# Altium project Lpad_28027_connect_Project _v1.1.PrjPcb
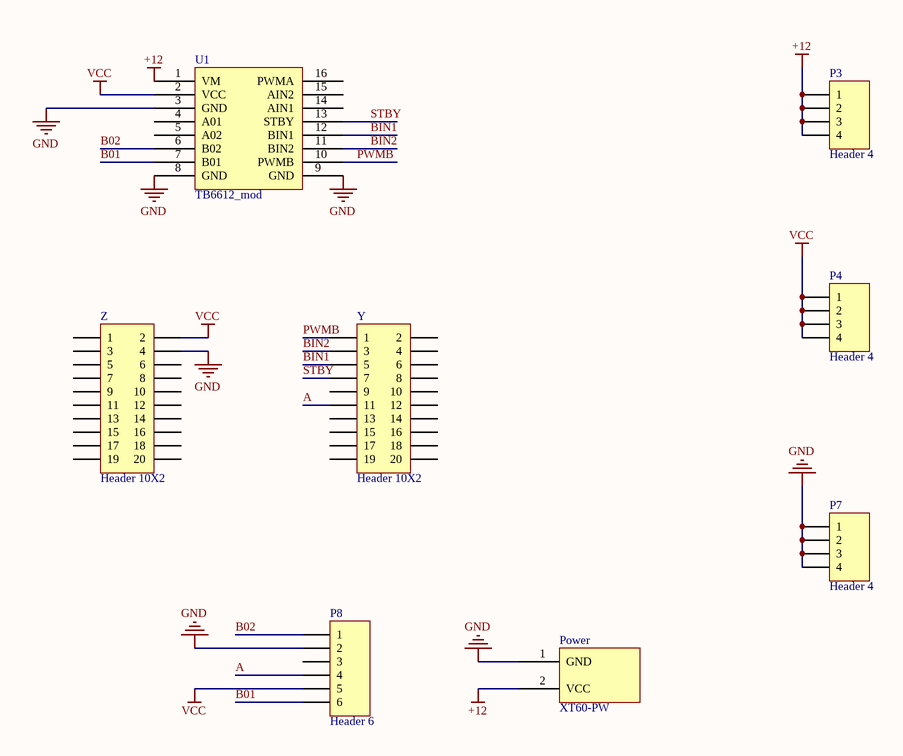
[diagram p0: mainboard.SchDoc]
1 sheet, 8 parts. Net scope: global (net labels, ports and power ports of the same name join across sheets).
Board file: main_PCB_v2.0.PcbDoc

## Sheet mainboard.SchDoc
size A4

### Parts
P3  Header 4  [HDR1X4]
P4  Header 4  [HDR1X4]
P7  Header 4  [HDR1X4]
P8  Header 6  [HDR1X6]
Power  XT60-PW  [XT60-PW]
U1  TB6612_mod  [TB6612_mod]
Y  Header 10X2  [HDR2X10]
Z  Header 10X2  [HDR2X10]

### Nets
+12: P3.1 P3.2 P3.3 P3.4 Power.2(VCC) U1.1(VM)
GND: P7.1 P7.2 P7.3 P7.4 P8.2 Power.1(GND) U1.3(GND) U1.8(GND) U1.9(GND) Z.4
VCC: P4.1 P4.2 P4.3 P4.4 P8.5 U1.2(VCC) Z.2
A: P8.4 Y.11
B01: P8.6 U1.7(B01)
B02: P8.1 U1.6(B02)
BIN1: U1.12(BIN1) Y.5
BIN2: U1.11(BIN2) Y.3
PWMB: U1.10(PWMB) Y.1
STBY: U1.13(STBY) Y.7

Not connected (* = marked no-connect by the designer): P8 3; U1 4(A01) 5(A02) 14(AIN1) 15(AIN2) 16(PWMA); Y 2 4 6 8 9 10 12 13 14 15 16 17 18 19 20; Z 1 3 5 6 7 8 9 10 11 12 13 14 15 16 17 18 19 20

### Library data of the parts
P3 P4 P7 = Header 4: Header, 4-Pin; LatestRevisionDate: 17-Jul-2002; LatestRevisionNote: Re-released for DXP Platform.; Publisher: Altium Limited
P8 = Header 6: Header, 6-Pin; LatestRevisionDate: 17-Jul-2002; LatestRevisionNote: Re-released for DXP Platform.; Publisher: Altium Limited
Y Z = Header 10X2: Header, 10-Pin, Dual row; LatestRevisionDate: 17-Jul-2002; LatestRevisionNote: Re-released for DXP Platform.; Publisher: Altium Limited